# Altium schematic sheet EsquematicoAD.SchDoc
size A4
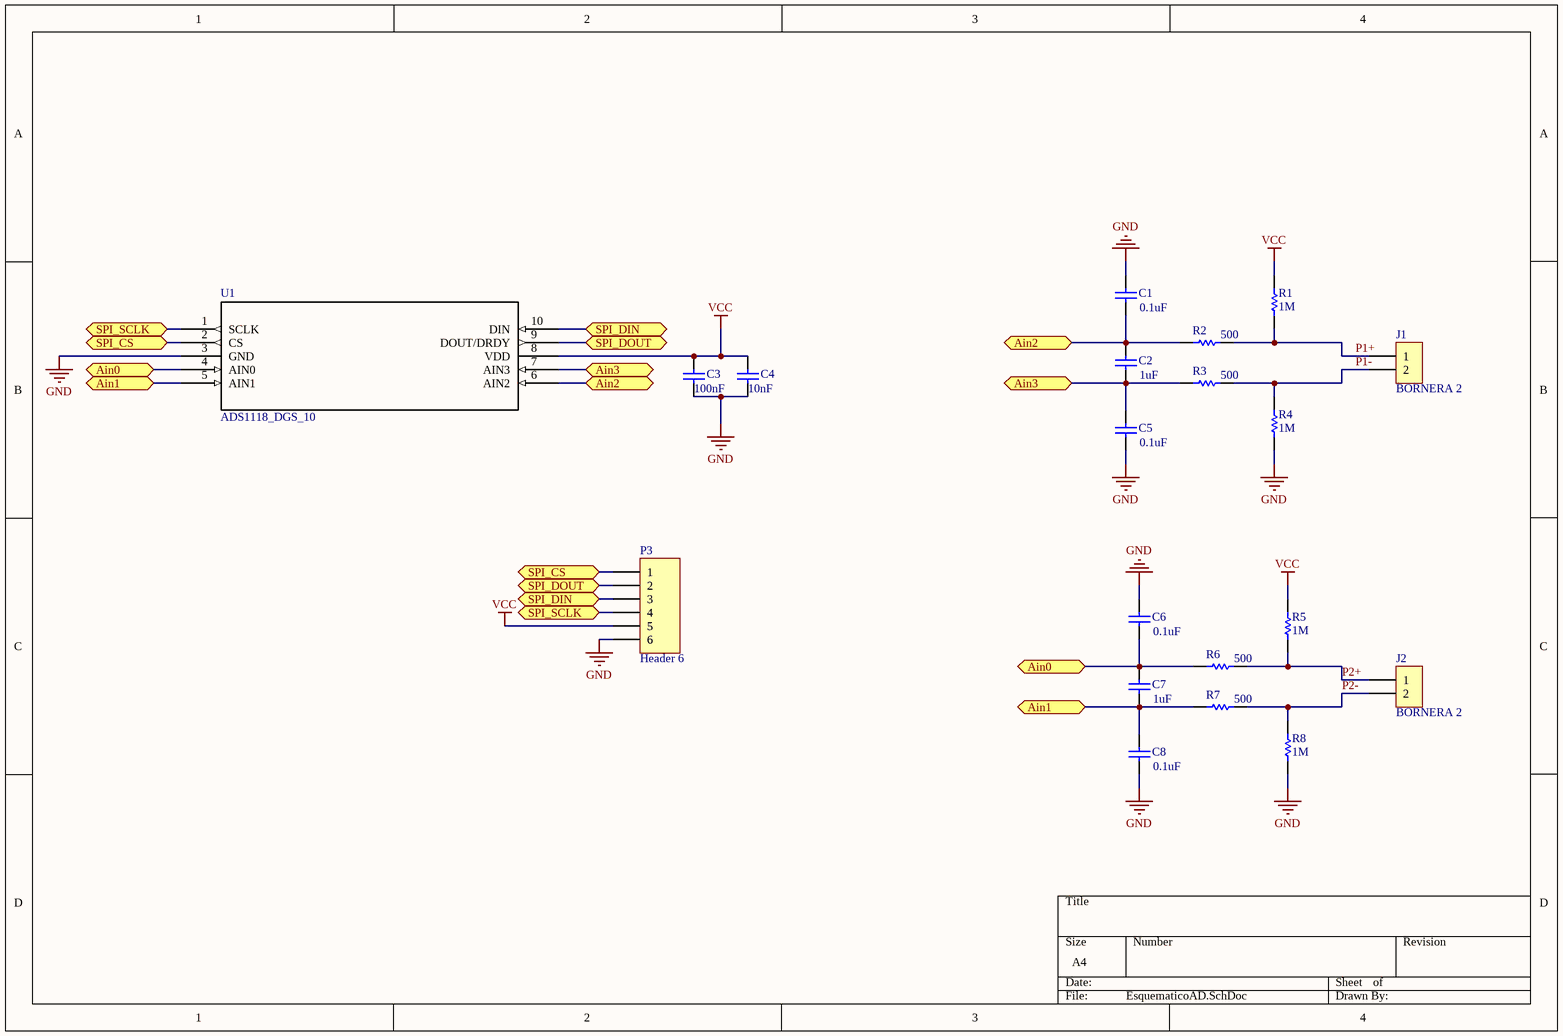
[diagram p0: EsquematicoAD.SchDoc]

## Parts
C1  value 0.1uF  [CAPR2.54-5.1x3.2]  (hidden comment: Cap)
C2  value 1uF  [CAPR2.54-5.1x3.2]  (hidden comment: Cap)
C3  value 100nF  [CAPR2.54-5.1x3.2]  (hidden comment: Cap)
C4  value 10nF  [CAPR2.54-5.1x3.2]  (hidden comment: Cap)
C5  value 0.1uF  [CAPR2.54-5.1x3.2]  (hidden comment: Cap)
C6  value 0.1uF  [CAPR2.54-5.1x3.2]  (hidden comment: Cap)
C7  value 1uF  [CAPR2.54-5.1x3.2]  (hidden comment: Cap)
C8  value 0.1uF  [CAPR2.54-5.1x3.2]  (hidden comment: Cap)
J1  BORNERA 2  [BORNERA 2]
J2  BORNERA 2  [BORNERA 2]
P3  Header 6  [HDR1X6]
R1  value 1M  [AXIAL-0.3]  (hidden comment: Res1)
R2  value 500  [AXIAL-0.3]  (hidden comment: Res1)
R3  value 500  [AXIAL-0.3]  (hidden comment: Res1)
R4  value 1M  [AXIAL-0.3]  (hidden comment: Res1)
R5  value 1M  [AXIAL-0.3]  (hidden comment: Res1)
R6  value 500  [AXIAL-0.3]  (hidden comment: Res1)
R7  value 500  [AXIAL-0.3]  (hidden comment: Res1)
R8  value 1M  [AXIAL-0.3]  (hidden comment: Res1)
U1  ADS1118_DGS_10  [DGS10]

## Ports
Ain0 (bidir), Ain1 (bidir), Ain2 (bidir), Ain3 (bidir), SPI_CS, SPI_CS (bidir), SPI_DIN (bidir), SPI_DOUT (bidir), SPI_SCLK (bidir)

## Nets
GND: C1.2 C3.1 C4.1 C5.1 C6.2 C8.1 P3.6 R4.2 R8.2 U1.3(GND)
VCC: C3.2 C4.2 P3.5 R1.2 R5.2 U1.8(VDD)
Ain0: C6.1 C7.2 R6.1 U1.4(AIN0) ; port Ain0
Ain1: C7.1 C8.2 R7.1 U1.5(AIN1) ; port Ain1
Ain2: C1.1 C2.2 R2.1 U1.6(AIN2) ; port Ain2
Ain3: C2.1 C5.2 R3.1 U1.7(AIN3) ; port Ain3
P1+: J1.1 R1.1 R2.2
P1-: J1.2 R3.2 R4.1
P2+: J2.1 R5.1 R6.2
P2-: J2.2 R7.2 R8.1
SPI_CS: P3.1 U1.2(CS) ; port SPI_CS
SPI_DIN: P3.3 U1.10(DIN) ; port SPI_DIN
SPI_DOUT: P3.2 U1.9(DOUT/DRDY) ; port SPI_DOUT
SPI_SCLK: P3.4 U1.1(SCLK) ; port SPI_SCLK

## Library data of the parts
C1-C8 = Cap: Capacitor; Published: 8-Jun-2000; LatestRevisionDate: 17-Jul-2002; LatestRevisionNote: Re-released for DXP Platform.; PackageReference: RAD-0.3; Publisher: Altium Limited
P3 = Header 6: Header, 6-Pin; LatestRevisionDate: 17-Jul-2002; LatestRevisionNote: Re-released for DXP Platform.; Publisher: Altium Limited
R1-R8 = Res1: Resistor; Published: 8-Jun-2000; LatestRevisionDate: 17-Jul-2002; LatestRevisionNote: Re-released for DXP Platform.; PackageReference: AXIAL-0.3; Publisher: Altium Limited
U1 = ADS1118_DGS_10: Imported; Manufacturer: Texas Instruments; INDUSTRY_STD_PKG_TYPE: MSOP; FAMILY_NAME: PRECISION ADC (<=10MSPS); PIN_COUNT: 10; PACKAGE_DESIGNATOR: DGS; Datasheet URL: http://www.ti.com/lit/gpn/ADS1118; GENERIC_PART_NUMBER: ADS1118; RefDes: RefDes; Type: DEV; Value: Value